# Altium schematic sheet ProjTemplate.SchDoc
size Tabloid; SheetTotal: 1; Organization: Hytorc, Inc.; Address1: 333 Rt. 17 N.; Address2: Mahwah, NJ; Address3: 07430; SheetNumber: 1
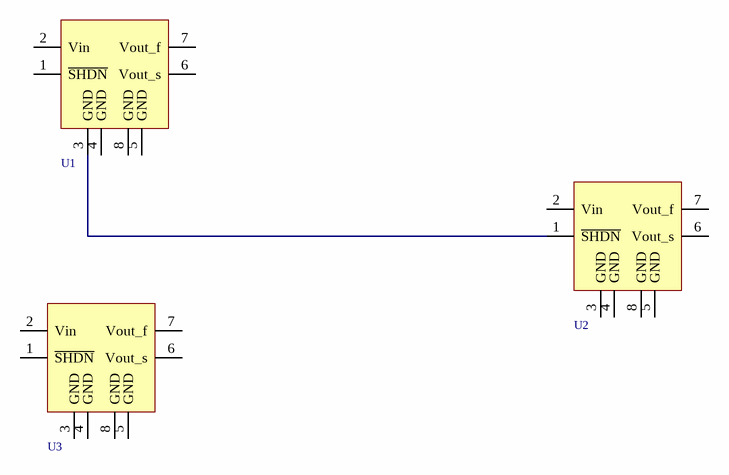
[diagram p0: ProjTemplate.SchDoc]

## Parts
U1  LTC6655  [LTC-MS8_MSOP-8]  (value not drawn)
U2  LTC6655  [LTC-MS8_MSOP-8]  (value not drawn)
U3  LTC6655  [LTC-MS8_MSOP-8]  (value not drawn)

## Nets
NetU1_3: U1.3(GND) U2.1(~{SHDN})

Not connected (* = marked no-connect by the designer): U1 1(~{SHDN}) 2(Vin) 4(GND) 5(GND) 6(Vout_s) 7(Vout_f) 8(GND); U2 2(Vin) 3(GND) 4(GND) 5(GND) 6(Vout_s) 7(Vout_f) 8(GND); U3 1(~{SHDN}) 2(Vin) 3(GND) 4(GND) 5(GND) 6(Vout_s) 7(Vout_f) 8(GND)

## Notes on the sheet
- Rev.
- Description
- Date
- Author
- © 2021 HYTORC, DIV. UNEX CORP.
- REF. DWG.
- PRORIETARY AND CONFIDENTIAL.
- Title:
- Size:
- Drawn:_________________________
  Date:__________________________
- B
- Sheet        of
- Drawing Number:
- Approved:______________________
  Date:__________________________
- Revision:
- THIS DRAWING IS THE PROPERTY OF UNEX CORPORATION AND THE INFORMATION THEREON IS TO BE TREATED AS CONFIDENTIAL. IT IS NOT TO BE USED, COPIED, OR DISCLOSED TO OUTSIDE PARTIES WITHOUT OUT WRITTEN CONSENT.

## Library data of the parts
U1-U3 = PR-3V3-011: 0.25ppm Noise, Low Drift Precision References; Manufacturer: Analog Devices; Manufacturer Part Number: LTC6655CHMS8-3.3#TRPBF; HPN: PR-3V3-011; DatasheetLink: Y:\Electrical_Engineering\Altium Component Libraries\Datasheets\LTC6655-6655LN.pdf#Y:\Electrical_Engineering\Altium Component Libraries\Datasheets\LTC6655-6655LN.pdf#